# EAGLE design untitled (EAGLE 9.0.0)
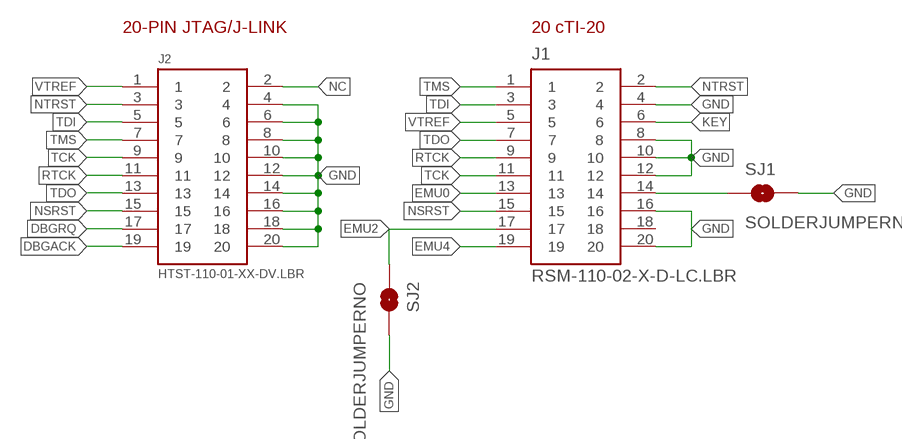
[diagram p0: schematic, sheet 1]

## Parts
J1  RSM-110-02-X-D-LC.LBR  [RSM-110-02-X-D-LC.LBR]
J2  HTST-110-01-XX-DV.LBR  [HTST-110-01-XX-DV.LBR]
SJ1  SOLDERJUMPERNO  [SJ_2S-NO]
SJ2  SOLDERJUMPERNO  [SJ_2S-NO]

## Nets
DBGACK: J2.19
DBGRQ: J2.17
EMU0: J1.13
EMU1: J1.14 SJ1.1
EMU2: J1.17 SJ2.1
EMU4: J1.19
GND: J1.4 J1.8 J1.10 J1.12 J1.16 J1.20 J2.4 J2.6 J2.8 J2.10 J2.12 J2.14 J2.16 J2.18 J2.20 SJ1.2 SJ2.2
KEY: J1.6
NC: J2.2
NSRST: J1.15 J2.15
NTRST: J1.2 J2.3
RTCK: J1.9 J2.11
TCK: J1.11 J2.9
TDI: J1.3 J2.5
TDO: J1.7 J2.13
TMS: J1.1 J2.7
VTREF: J1.5 J2.1
Unconnected: J1.18

## Notes on the sheet
- 20-PIN JTAG/J-LINK | 20 cTI-20

## Library data of the parts
J1 = RSM-110-02-X-D-LC:RSM-110-02-X-D-LC.LBR: Receptacle surface mount
J2 = HTST-110-01-XX-DV:HTST-110-01-XX-DV.LBR: HIGH TEMP TOP SHROUD.
SJ1 SJ2 = SparkFun-Passives:SOLDERJUMPER: Solder Jumper Standard SMD solder jumper. Used to automate production. Two varients : Normally Open and Normally Closed are the same, but have different paste layers. NC will have a large amount of paste and should jumper during reflow.

## Board
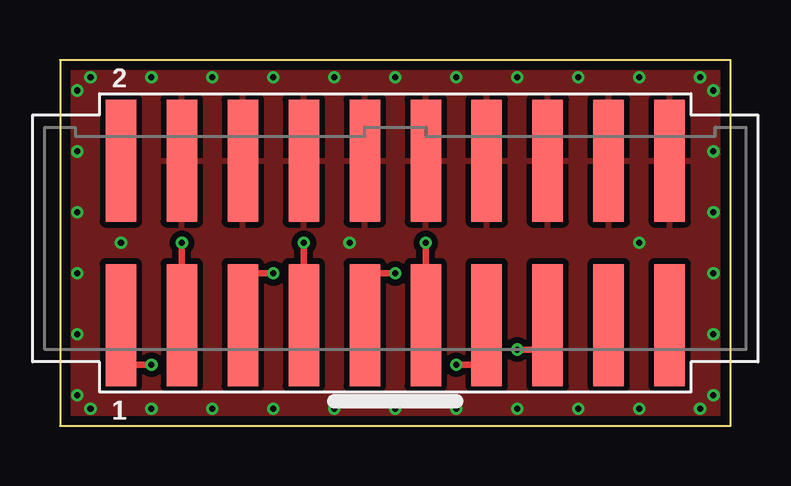
[diagram p1: board, top side]
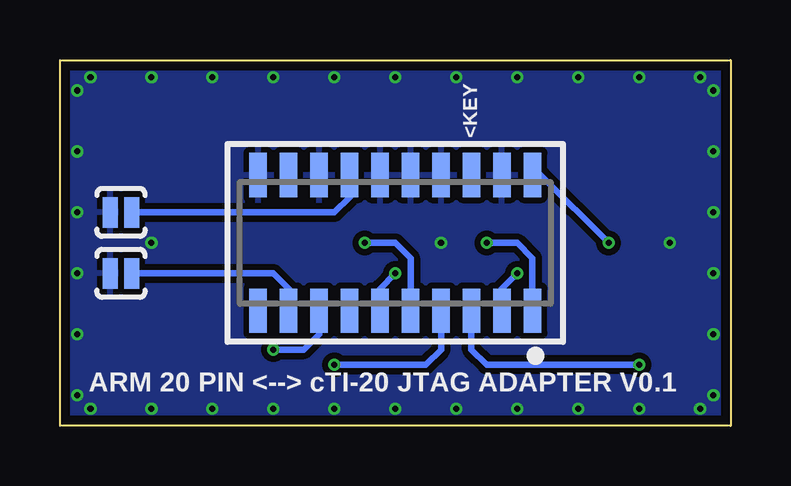
[diagram p2: board, bottom side, seen from below]

Size 27.94 x 15.24 mm. Coordinates in mm from the lower left corner, seen from the top.
Outline: 0,0 27.94,0 27.94,15.24 0,15.24 0,0
Copper layers (1*16): Top 0.035559375mm / dielectric 1.6mm / Bottom 0.035559375mm
Design rules "oshpark-2layer-tented": minimum track width 6mil, minimum drill 10mil, track to track 6mil, track to pad 6mil, pad to pad 6mil, via to via 6mil, smd to smd 6mil, copper to edge 15mil, drill to drill 6mil, minimum pad ring 5mil, minimum via ring 5mil, stop-mask expansion 2.5mil, vias tented up to drill 20mil, thermal gap 10mil

### Footprints (pad centres in the part's own frame; a part is rotated, then mirrored left to right if it is on the bottom)
RSM-110-02-X-D-LC.LBR = smd 0.737 x 1.841: 1 5.715,-2.826; 2 5.715,2.826; 3 4.445,-2.826; 4 4.445,2.826; 5 3.175,-2.826; 6 3.175,2.826; 7 1.905,-2.826; 8 1.905,2.826; 9 0.635,-2.826; 10 0.635,2.826; 11 -0.635,-2.826; 12 -0.635,2.826; 13 -1.905,-2.826; 14 -1.905,2.826; 15 -3.175,-2.826; 16 -3.175,2.826; 17 -4.445,-2.826; 18 -4.445,2.826; 19 -5.715,-2.826; 20 -5.715,2.826
HTST-110-01-XX-DV.LBR = smd 1.27 x 5.08: 1 -11.43,-3.429; 2 -11.43,3.429; 3 -8.89,-3.429; 4 -8.89,3.429; 5 -6.35,-3.429; 6 -6.35,3.429; 7 -3.81,-3.429; 8 -3.81,3.429; 9 -1.27,-3.429; 10 -1.27,3.429; 11 1.27,-3.429; 12 1.27,3.429; 13 3.81,-3.429; 14 3.81,3.429; 15 6.35,-3.429; 16 6.35,3.429; 17 8.89,-3.429; 18 8.89,3.429; 19 11.43,-3.429; 20 11.43,3.429
SJ_2S-NO = smd 0.635 x 1.27: 1 -0.45,0; 2 0.45,0

### Placement (x,y rotation side)
J1  13.97,7.62 0 bottom
J2  13.97,7.62 0 top
SJ1  25.4,8.89 180 bottom
SJ2  25.4,6.35 180 bottom

### Tracks (layer width: path | path; a pad name or v marks a point on that pad's centre or on a via)
EMU1
  Bottom 0.279: J1.14 15.88,9.53 16.51,8.89 SJ1.1
EMU2
  Bottom 0.279: J1.17 18.41,5.71 19.05,6.35 SJ2.1
GND  (via drill 0.25)
  other vias: 1.27,14.53 3.81,14.53 6.35,14.53 8.89,14.53 11.43,14.53 13.97,14.53 16.51,14.53 19.05,14.53 21.59,14.53 24.13,14.53 26.67,14.53 1.27,0.71 3.81,0.71 6.35,0.71 8.89,0.71 11.43,0.71 13.97,0.71 16.51,0.71 19.05,0.71 21.59,0.71 24.13,0.71 26.67,0.71 0.71,1.27 0.71,3.81 27.23,1.27 27.23,3.81 27.23,6.35 27.23,8.89 27.23,11.43 27.23,13.97 0.71,6.35 0.71,8.89 0.71,11.43 0.71,13.97 12.06,7.62 2.54,7.62 24.13,7.62
  pour Bottom (isolate 0.254): 0,15.24 0,0 27.94,0 27.94,15.24
  pour Top (isolate 0.254): 0,15.24 0,0 27.94,0 27.94,15.24
NSRST  (via drill 0.25)
  Top 0.279: J2.15 20.32,3.17 v19.05,3.17
  Bottom 0.279: v19.05,3.17 17.78,3.17 17.14,3.81 J1.15
NTRST  (via drill 0.25)
  Top 0.279: J2.3 v5.08,7.62
  Bottom 0.279: v5.08,7.62 7.91,10.45 J1.2
RTCK  (via drill 0.25)
  Top 0.279: J2.11 v15.24,7.62
  Bottom 0.279: v15.24,7.62 13.97,7.62 13.34,6.99 J1.9
TCK  (via drill 0.25)
  Top 0.279: J2.9 12.7,6.35 v13.97,6.35
  Bottom 0.279: v13.97,6.35 14.61,5.71 J1.11
TDI  (via drill 0.25)
  Top 0.279: J2.5 7.62,6.35 v8.89,6.35
  Bottom 0.279: v8.89,6.35 9.53,5.71 J1.3
TDO  (via drill 0.25)
  Top 0.279: J2.13 17.78,2.54 v16.51,2.54
  Bottom 0.279: J1.7 12.06,3.17 12.7,2.54 v16.51,2.54
TMS  (via drill 0.25)
  Top 0.279: J2.7 v10.16,7.62
  Bottom 0.279: v10.16,7.62 8.89,7.62 8.26,6.99 J1.1
VTREF  (via drill 0.25)
  Top 0.279: J2.1 2.54,2.54 v3.81,2.54
  Bottom 0.279: J1.5 10.79,3.17 10.16,2.54 v3.81,2.54

### Text on the board
bPlace: <KEY | ARM 20 PIN <--> cTI-20 JTAG ADAPTER V0.1